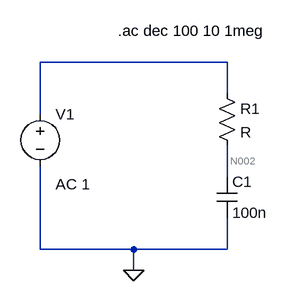
[diagram p0: schematic Prj2.asc]
Prj2.asc, the LTspice schematic file:
Version 4.1
SHEET 1 880 680
WIRE 272 96 -16 96
WIRE 272 144 272 96
WIRE -16 176 -16 96
WIRE 272 272 272 224
WIRE -16 384 -16 256
WIRE 128 384 -16 384
WIRE 272 384 272 336
WIRE 272 384 128 384
WIRE 128 416 128 384
FLAG 128 416 0
SYMBOL voltage -16 160 R0
WINDOW 123 24 124 Left 2
WINDOW 39 0 0 Left 0
SYMATTR InstName V1
SYMATTR Value ""
SYMATTR Value2 AC 1
SYMBOL res 256 128 R0
SYMATTR InstName R1
SYMBOL cap 256 272 R0
SYMATTR InstName C1
SYMATTR Value 100n
TEXT 104 48 Left 2 !.ac dec 100 10 1meg

The netlist it stands for:
* Prj2.asc
V1 N001 0 AC 1
R1 N001 N002 R
C1 N002 0 100n
.ac dec 100 10 1meg
.backanno
.end

* Results of the author's LTspice run, read from the files saved beside the schematic
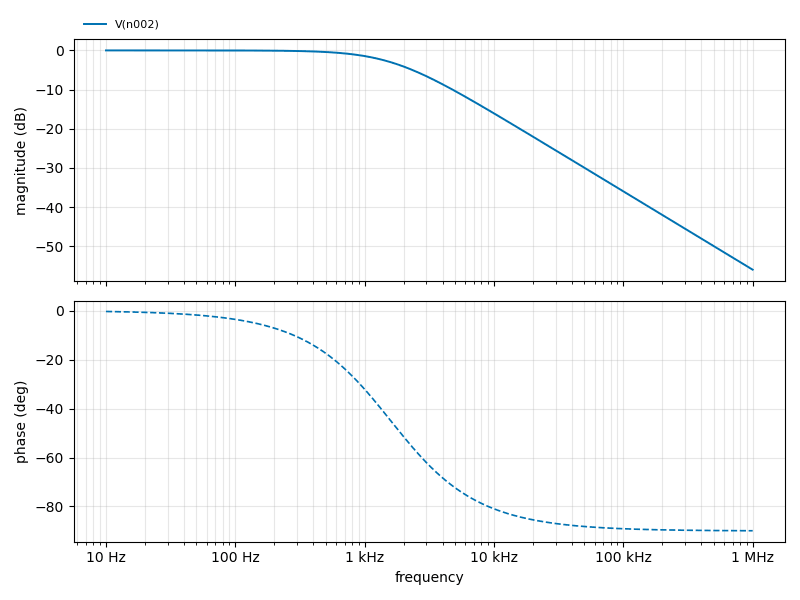
[diagram p1: AC Analysis of Prj2.asc, plotted from the saved traces]
* AC Analysis, 1 run:
*   V(n002): -0.00 dB at 10 Hz, -55.96 dB at 1 MHz, peak -0.00 dB at 10 Hz, 3 dB below the peak at 1.592 kHz